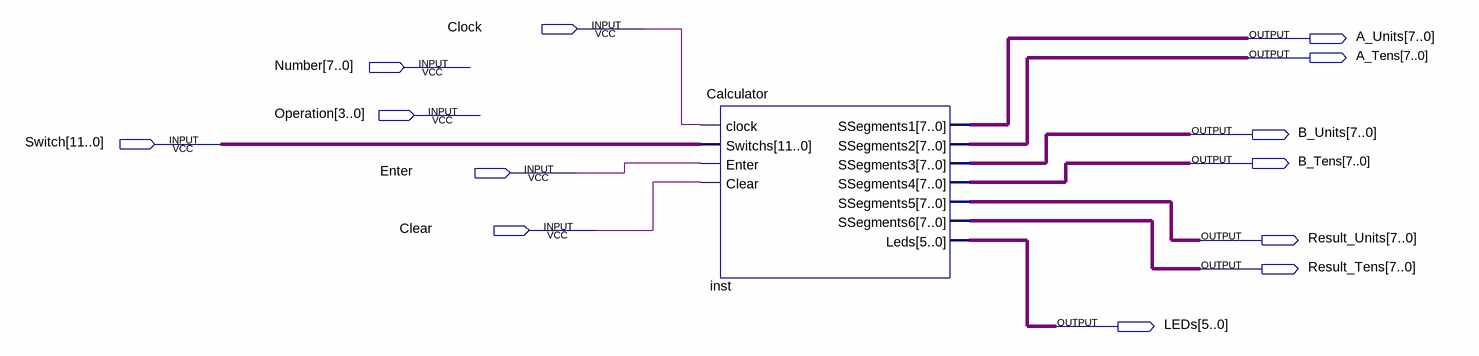
[diagram p0: schematic sheet]
// Quartus schematic TestCalculator.bdf as structural Verilog: 1 symbols, 13 pins
module TestCalculator (
  input  Clock,
  input  [7:0] Number,
  input  [3:0] Operation,
  input  [11:0] Switch,
  input  Enter,
  input  Clear,
  output [7:0] A_Units,
  output [7:0] A_Tens,
  output [7:0] B_Units,
  output [7:0] B_Tens,
  output [7:0] Result_Units,
  output [7:0] Result_Tens,
  output [5:0] LEDs
);

  Calculator inst (
    .clock(Clock), .Switchs(Switch), .Enter(Enter), .Clear(Clear), .SSegments1(A_Units), .SSegments2(A_Tens),
    .SSegments3(B_Units), .SSegments4(B_Tens), .SSegments5(Result_Units), .SSegments6(Result_Tens),
    .Leds(LEDs));
endmodule
